# Altium project CONTROLLER_TRK_HV3.PrjPcb
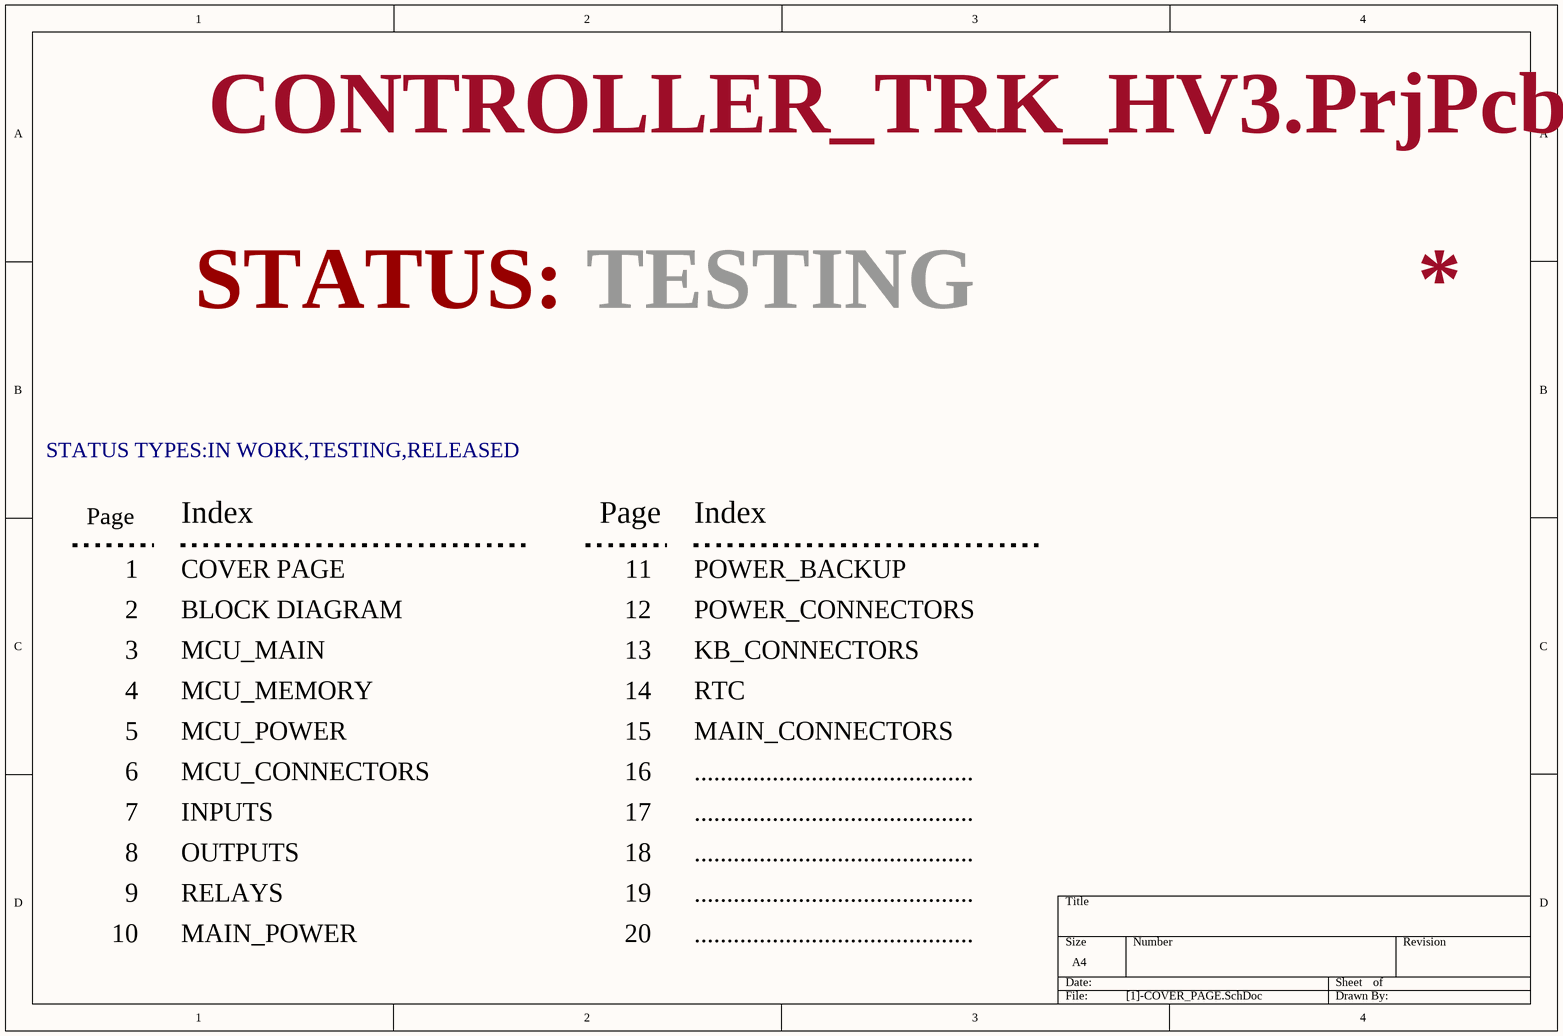
[diagram p0: [1]-COVER_PAGE.SchDoc]
15 sheets, 215 parts. Net scope: flat (ports and power ports of the same name join across sheets).
Board file: CONTROLLER_TRK_HV3.PcbDoc
Sheets:
  [1]-COVER_PAGE.SchDoc
  [2]-BLOCK_DIAGRAM.SchDoc
  [3]-MCU_MAIN.SchDoc
  [4]-MCU_MEMORY.SchDoc
  [5]-MCU_POWER.SchDoc
  [6]-MCU_CONNECTORS.SchDoc
  [7]-INPUTS.SchDoc
  [8]-OUTPUTS.SchDoc
  [9]-RELAYS.SchDoc
  [10]-MAIN_POWER.SchDoc
  [11]-POWER_BACKUP.SchDoc
  [12]-POWER_CONNECTORS.SchDoc
  [13]-KB_CONNECTORS.SchDoc
  [14]-RTC.SchDoc
  [15]-MAIN_CONNECTORS.SchDoc

## Sheet [1]-COVER_PAGE.SchDoc
size A4

### Notes on the sheet
- STATUS:
- TESTING
- STATUS TYPES:IN WORK,TESTING,RELEASED
- Page
- 1
- Index
- COVER PAGE
- 11
- POWER_BACKUP
- 2
- BLOCK DIAGRAM
- 12
- POWER_CONNECTORS
- 3
- 4
- MCU_MAIN
- MCU_MEMORY
- 13
- 14
- RTC
- KB_CONNECTORS
- 5
- 6
- MCU_POWER
- MCU_CONNECTORS
- 15
- 16
- MAIN_CONNECTORS
- ...........................................
- 7
- INPUTS
- 17
- 8
- 9
- OUTPUTS
- RELAYS
- 18
- 19
- 10
- MAIN_POWER
- 20

## Sheet [2]-BLOCK_DIAGRAM.SchDoc
size A4
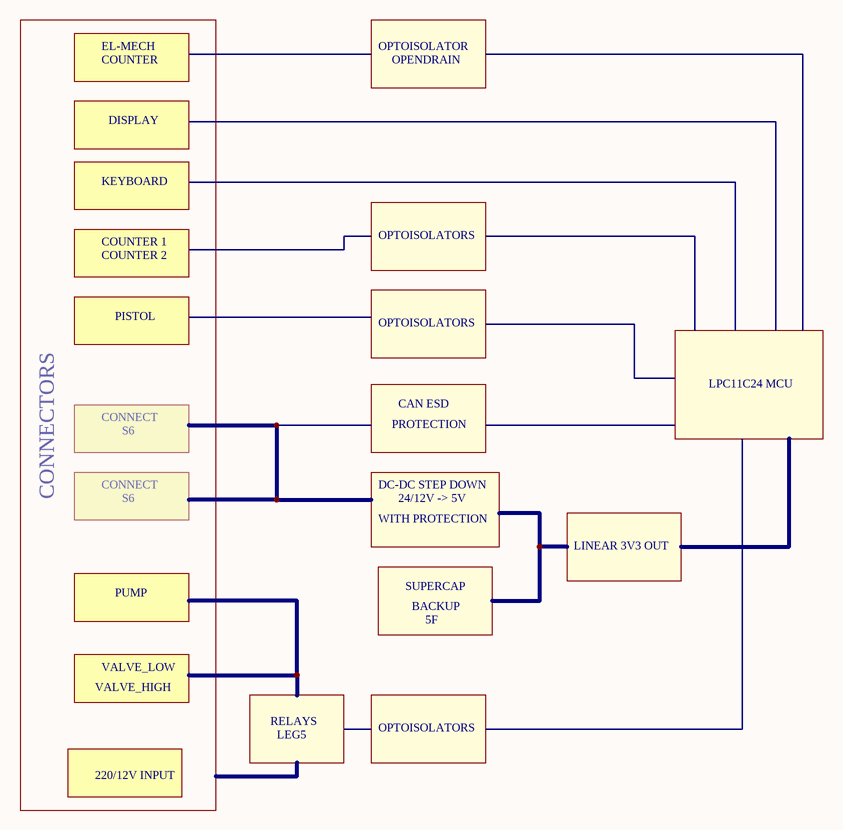
[diagram p1: [2]-BLOCK_DIAGRAM.SchDoc]

### Notes on the sheet
- EL-MECH
- COUNTER
- OPTOISOLATOR
- OPENDRAIN
- DISPLAY
- COUNTER 1
- KEYBOARD
- OPTOISOLATORS
- COUNTER 2
- PISTOL
- CONNECT
- S6
- PROTECTION
- CAN ESD
- LPC11C24 MCU
- CONNECTORS
- DC-DC STEP DOWN
- 24/12V -> 5V
- WITH PROTECTION
- LINEAR 3V3 OUT
- PUMP
- SUPERCAP
- BACKUP
- 5F
- VALVE_HIGH
- VALVE_LOW
- 220/12V INPUT
- RELAYS
- LEG5

## Sheet [3]-MCU_MAIN.SchDoc
size A4
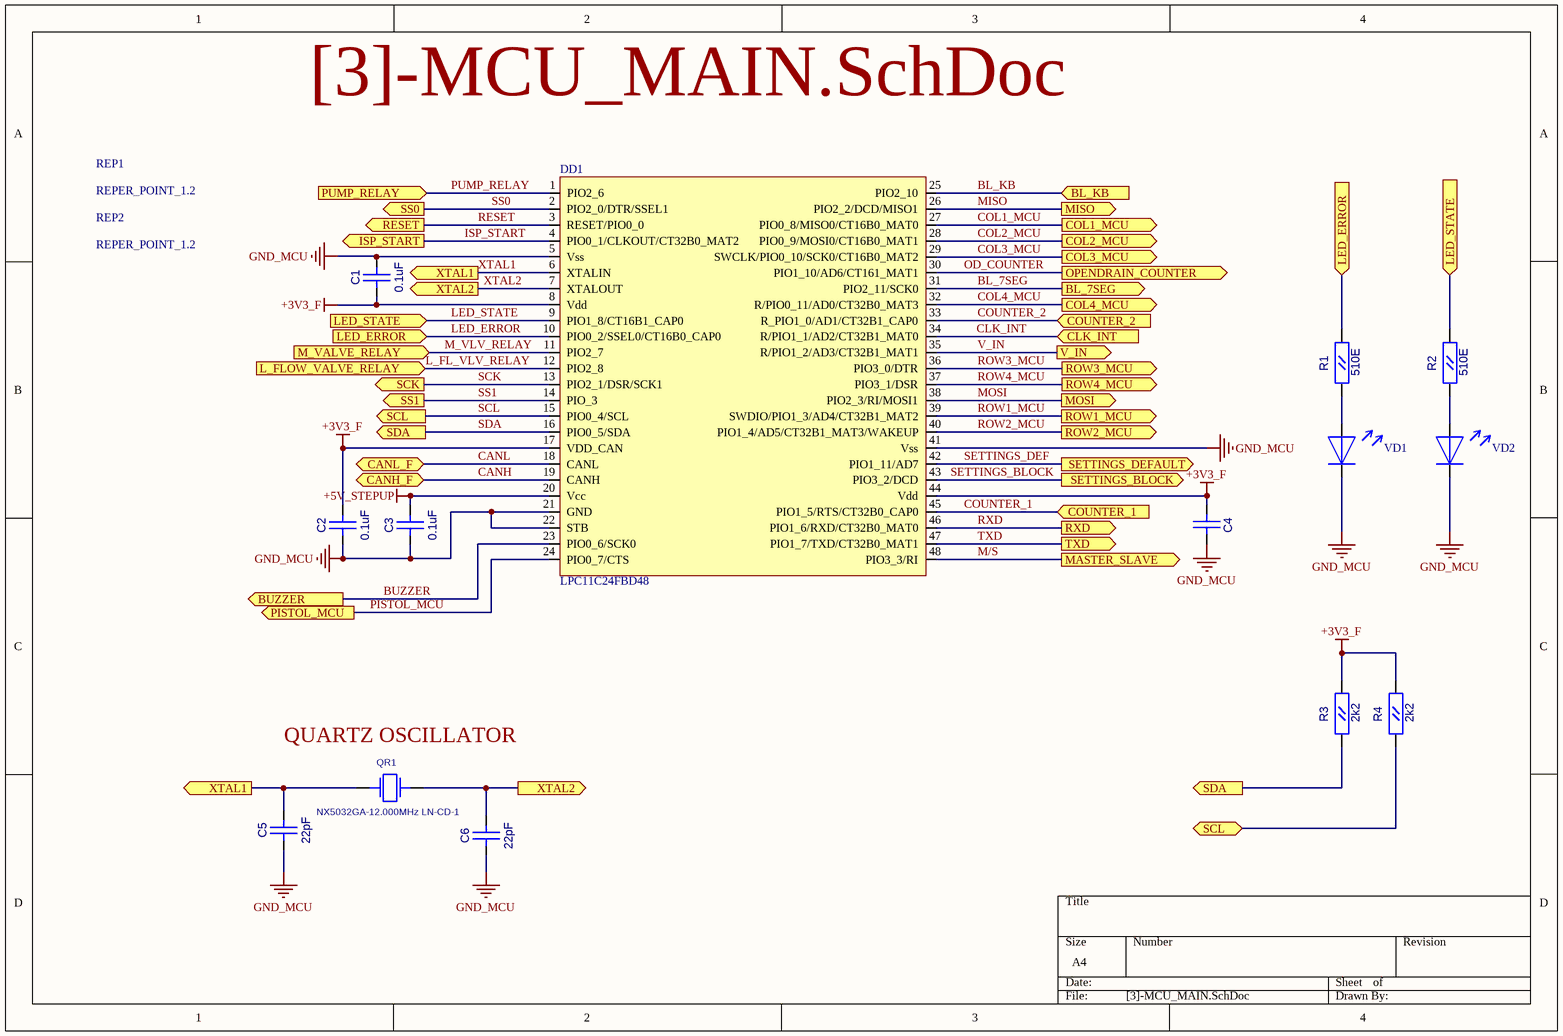
[diagram p2: [3]-MCU_MAIN.SchDoc]

### Parts
C1  0.1uF  [CC0603]
C2  0.1uF  [CC0603]
C3  0.1uF  [CC0603]
C4  (no value)  [CC0603]
C5  22pF  [CC0603]
C6  22pF  [CC0603]
DD1  LPC11C24FBD48  [LQFP48]
QR1  NX5032GA-12.000MHz LN-CD-1  [AC5032_2]
R1  510E  [RC0603]
R2  510E  [RC0603]
R3  2k2  [RC0603]
R4  2k2  [RC0603]
REP1  REPER_POINT_1.2  [REPER1.2]
REP2  REPER_POINT_1.2  [REPER1.2]
VD1  LED_0805  [LED0805]  (value not drawn)
VD2  LED_0805  [LED0805]  (value not drawn)

### Ports
BL_7SEG (out), BL_KB (in), BUZZER (out), CANH_F (bidir), CANL_F (bidir), CLK_INT (in), COL1_MCU (out), COL2_MCU (out), COL3_MCU (out), COL4_MCU (out), COUNTER_1 (in), COUNTER_2 (in), ISP_START (out), L_FLOW_VALVE_RELAY (in), LED_ERROR (in), LED_STATE (in), M_VALVE_RELAY (in), MASTER_SLAVE (out), MISO (out), MOSI (out), OPENDRAIN_COUNTER (out), PISTOL_MCU (out), PUMP_RELAY (in), RESET (out), ROW1_MCU (out), ROW2_MCU (out), ROW3_MCU (out), ROW4_MCU (out), RXD (out), SCK (out), SCL (bidir), SCL (out), SDA (out), SETTINGS_BLOCK (out), SETTINGS_DEFAULT (out), SS0 (out), SS1 (out), TXD (out), V_IN (out), XTAL1 (out), XTAL2 (out)

### Nets
+3V3_F: C1.1(A) C2.2(B) C4.1(A) DD1.8(Vdd) DD1.17(VDD_CAN) DD1.44(Vdd) R3.2(B) R4.2(B)
+5V_STEPUP: C3.2(B) DD1.20(Vcc)
GND_MCU: C1.2(B) C2.1(A) C3.1(A) C4.2(B) C5.1(A) C6.1(A) DD1.5(Vss) DD1.21(GND) DD1.22(STB) DD1.41(Vss) VD1.2 VD2.2
BL_7SEG: DD1.31(PIO2_11/SCK0) ; port BL_7SEG
BL_KB: DD1.25(PIO2_10) ; port BL_KB
BUZZER: DD1.23(PIO0_6/SCK0) ; port BUZZER
CANH: DD1.19(CANH) ; port CANH_F
CANL: DD1.18(CANL) ; port CANL_F
CLK_INT: DD1.34(R/PIO1_1/AD2/CT32B1_MAT0) ; port CLK_INT
COL1_MCU: DD1.27(PIO0_8/MISO0/CT16B0_MAT0) ; port COL1_MCU
COL2_MCU: DD1.28(PIO0_9/MOSI0/CT16B0_MAT1) ; port COL2_MCU
COL3_MCU: DD1.29(SWCLK/PIO0_10/SCK0/CT16B0_MAT2) ; port COL3_MCU
COL4_MCU: DD1.32(R/PIO0_11/AD0/CT32B0_MAT3) ; port COL4_MCU
COUNTER_1: DD1.45(PIO1_5/RTS/CT32B0_CAP0) ; port COUNTER_1
COUNTER_2: DD1.33(R_PIO1_0/AD1/CT32B1_CAP0) ; port COUNTER_2
ISP_START: DD1.4(PIO0_1/CLKOUT/CT32B0_MAT2) ; port ISP_START
L_FL_VLV_RELAY: DD1.12(PIO2_8) ; port L_FLOW_VALVE_RELAY
LED_ERROR: DD1.10(PIO0_2/SSEL0/CT16B0_CAP0) R1.2(B) ; port LED_ERROR
LED_STATE: DD1.9(PIO1_8/CT16B1_CAP0) R2.2(B) ; port LED_STATE
M/S: DD1.48(PIO3_3/RI) ; port MASTER_SLAVE
M_VLV_RELAY: DD1.11(PIO2_7) ; port M_VALVE_RELAY
MISO: DD1.26(PIO2_2/DCD/MISO1) ; port MISO
MOSI: DD1.38(PIO2_3/RI/MOSI1) ; port MOSI
OD_COUNTER: DD1.30(PIO1_10/AD6/CT161_MAT1) ; port OPENDRAIN_COUNTER
PISTOL_MCU: DD1.24(PIO0_7/CTS) ; port PISTOL_MCU
PUMP_RELAY: DD1.1(PIO2_6) ; port PUMP_RELAY
RESET: DD1.3(RESET/PIO0_0) ; port RESET
ROW1_MCU: DD1.39(SWDIO/PIO1_3/AD4/CT32B1_MAT2) ; port ROW1_MCU
ROW2_MCU: DD1.40(PIO1_4/AD5/CT32B1_MAT3/WAKEUP) ; port ROW2_MCU
ROW3_MCU: DD1.36(PIO3_0/DTR) ; port ROW3_MCU
ROW4_MCU: DD1.37(PIO3_1/DSR) ; port ROW4_MCU
RXD: DD1.46(PIO1_6/RXD/CT32B0_MAT0) ; port RXD
SCK: DD1.13(PIO2_1/DSR/SCK1) ; port SCK
SCL: DD1.15(PIO0_4/SCL) R4.1(A) ; port SCL
SDA: DD1.16(PIO0_5/SDA) R3.1(A) ; port SDA
SETTINGS_BLOCK: DD1.43(PIO3_2/DCD) ; port SETTINGS_BLOCK
SETTINGS_DEF: DD1.42(PIO1_11/AD7) ; port SETTINGS_DEFAULT
SS0: DD1.2(PIO2_0/DTR/SSEL1) ; port SS0
SS1: DD1.14(PIO_3) ; port SS1
TXD: DD1.47(PIO1_7/TXD/CT32B0_MAT1) ; port TXD
V_IN: DD1.35(R/PIO1_2/AD3/CT32B1_MAT1) ; port V_IN
XTAL1: C5.2(B) DD1.6(XTALIN) QR1.1 ; port XTAL1
XTAL2: C6.2(B) DD1.7(XTALOUT) QR1.2 ; port XTAL2
NetR1_1: R1.1(A) VD1.1
NetR2_1: R2.1(A) VD2.1

Not connected (* = marked no-connect by the designer): REP1 1; REP2 1

### Notes on the sheet
- (near QR1) QUARTZ OSCILLATOR

### Library data of the parts
C1-C6 = CC0603
  C1-C3: Value: 0.1uF
  C5 C6: Value: 22pF
QR1 = AC5032_2: AC5032/2; Value: NX5032GA-12.000MHz LN-CD-1
R1-R4 = RC0603
  R1 R2: Value: 510E
  R3 R4: Value: 2k2
REP1 REP2 = REPER1.2: Value: REPER_POINT_1.2
DD1 = LPC11C24FBD48: Value: LPC11C24FBD48
VD1 VD2 = LED_0805: Value: LED_0805

## Sheet [4]-MCU_MEMORY.SchDoc
size A4
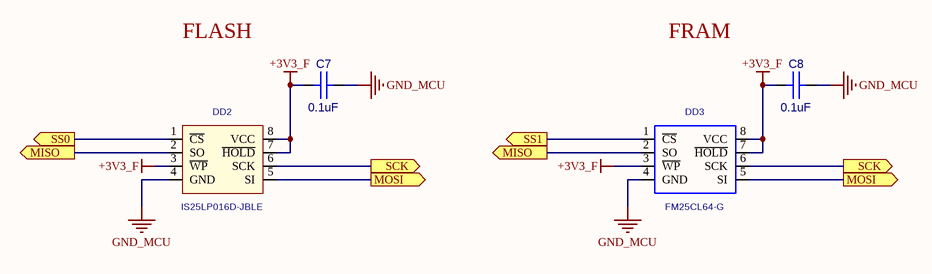
[diagram p3: [4]-MCU_MEMORY.SchDoc]

### Parts
C7  0.1uF  [CC0603]
C8  0.1uF  [CC0603]
DD2  IS25LP016D-JBLE  [EIAJ_SO8]
DD3  FM25CL64-G  [SO-8]

### Ports
MISO (out), MOSI (out), SCK (out), SS0 (out), SS1 (out)

### Nets
+3V3_F: C7.1(A) C8.1(A) DD2.3(~{WP}) DD2.7(~{HOLD}) DD2.8(VCC) DD3.3(~{WP}) DD3.7(~{HOLD}) DD3.8(VCC)
GND_MCU: C7.2(B) C8.2(B) DD2.4(GND) DD3.4(GND)
MISO: DD2.2(SO) DD3.2(SO) ; port MISO
MOSI: DD2.5(SI) DD3.5(SI) ; port MOSI
SCK: DD2.6(SCK) DD3.6(SCK) ; port SCK
SS0: DD2.1(~{CS}) ; port SS0
SS1: DD3.1(~{CS}) ; port SS1

### Notes on the sheet
- FLASH
- FRAM

### Library data of the parts
C7 C8 = CC0603: Value: 0.1uF
DD2 = S25FL016A0LMFI01: Value: IS25LP016D-JBLE
DD3 = FM25CL64-G: Value: *

## Sheet [5]-MCU_POWER.SchDoc
size A4
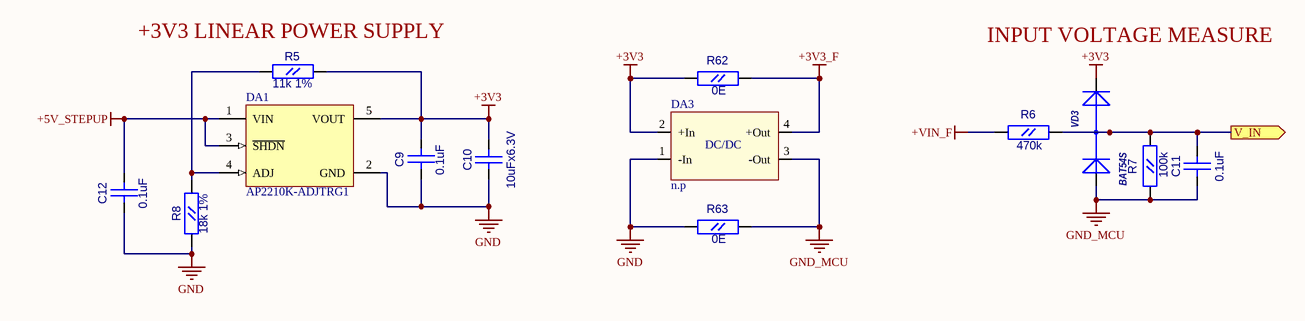
[diagram p4: [5]-MCU_POWER.SchDoc]

### Parts
C9  0.1uF  [CC0603]
C10  10uFx6.3V  [CC0805]
C11  0.1uF  [CC0603]
C12  0.1uF  [CC0603]
DA1  AP2210K-ADJTRG1  [SOT23-5]
DA3  n.p  [CME0303S3C]
R5  11k 1%  [RC0603]
R6  470k  [RC0603]
R7  100k  [RC0603]
R8  18k 1%  [RC0603]
R62  0E  [RC0805]
R63  0E  [RC0805]
VD3  BAT54S  [SOT-23(GSD)]

### Ports
V_IN (out)

### Nets
+3V3: C9.1(A) C10.2(B) DA1.5(VOUT) DA3.2(+In) R5.2(B) R62.1(A) VD3.2(K)
+3V3_F: DA3.4(+Out) R62.2(B)
+5V_STEPUP: C12.1(A) DA1.1(VIN) DA1.3(~{SHDN})
+VIN_F: R6.1(A)
GND: C9.2(B) C10.1(A) C12.2(B) DA1.2(GND) DA3.1(-In) R8.1(A) R63.1(A)
GND_MCU: C11.1(A) DA3.3(-Out) R7.1(A) R63.2(B) VD3.1(A)
V_IN: C11.2(B) R6.2(B) R7.2(B) VD3.3(AK) ; port V_IN
NetDA1_4: DA1.4(ADJ) R5.1(A) R8.2(B)

### Notes on the sheet
- (near R5) +3V3 LINEAR POWER SUPPLY
- (near VD3) INPUT VOLTAGE MEASURE
- (in symbol CME0303S3C) DC/DC

### Library data of the parts
C9 C11 C12 = CC0603: Value: 0.1uF
C10 = CC0805: Value: 10uFx6.3V
DA1 = MCP1824T-ADJE/OT: 300 mA, Low Voltage, Low Quiescent Current LDO Regulator, 5-Pin SOT-223, Extended Temperature, Tape and Reel; Published: 29-Jan-2009; DatasheetVersion: revA, Aug-2007; PackageVersion: revAW, Oct-2008; PackageReference: SOT-223-DC5; Publisher: Altium Limited; PackageDescription: 5-Lead Plastic Small Outline Transistor (DC) [SOT-223]; ComponentLink1Description: Manufacturer Link; ComponentLink1URL: http://www.microchip.com; ComponentLink2Description: Datasheet; ComponentLink2URL: http://ww1.microchip.com/downloads/en/DeviceDoc/22070a.pdf; ComponentLink3Description: Packaging Specification; ComponentLink3URL: http://ww1.microchip.com/downloads/en/PackagingSpec/00049AW.pdf
DA3 = CME0303S3C: DC/DC converter
R5-R8 = RC0603
  R5: Value: 11k 1%
  R6: Value: 470k
  R7: Value: 100k
  R8: Value: 18k 1%
R62 R63 = RC0805: Value: 0E
VD3 = BAT54S: 1.0 Ampere General Purpose Rectifier; ComponentField6: Published 8-Jun-2000, Modified 11-July-2000: SIM Model Added.; Value: *

## Sheet [6]-MCU_CONNECTORS.SchDoc
size A4
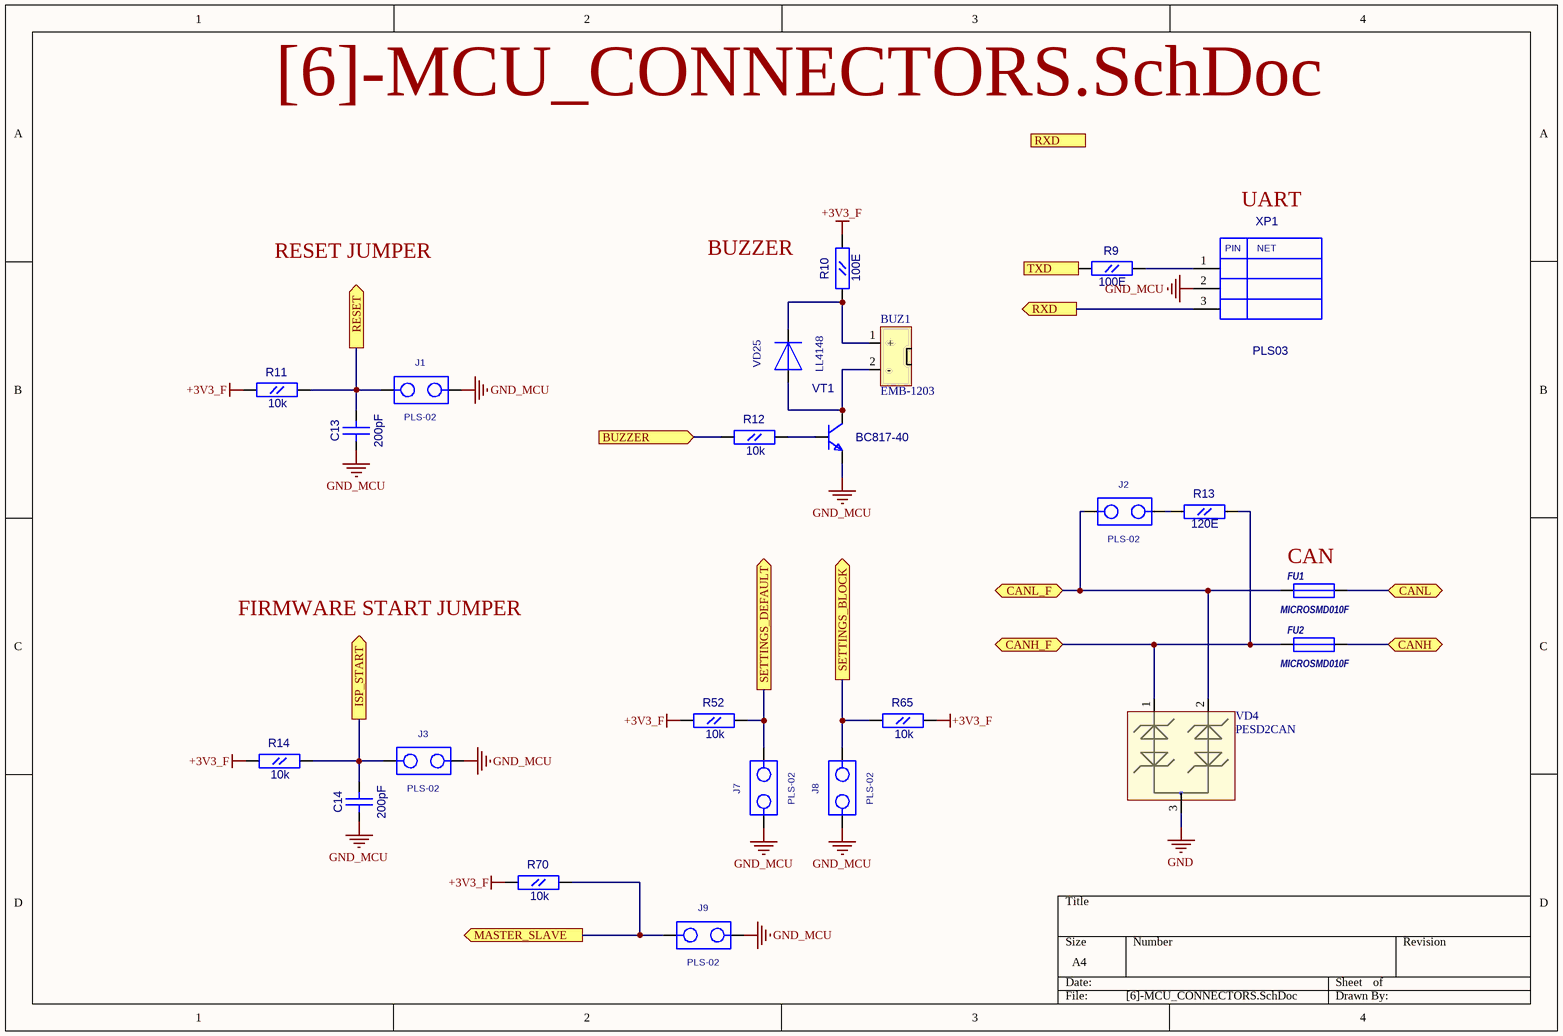
[diagram p5: [6]-MCU_CONNECTORS.SchDoc]

### Parts
BUZ1  EMB-1203  [BUZZER_12]
C13  200pF  [CC0603]
C14  200pF  [CC0603]
FU1  MICROSMD010F  [RC1210]
FU2  MICROSMD010F  [RC1210]
J1  PLS-02  [PLS-02]
J2  PLS-02  [PLS-02]
J3  PLS-02  [PLS-02]
J7  PLS-02  [PLS-02]
J8  PLS-02  [PLS-02]
J9  PLS-02  [PLS-02]
R9  100E  [RC0603]
R10  100E  [RC0603]
R11  10k  [RC0603]
R12  10k  [RC0603]
R13  120E  [RC0805]
R14  10k  [RC0603]
R52  10k  [RC0603]
R65  10k  [RC0603]
R70  10k  [RC0603]
VD4  PESD2CAN  [SOT-23(123)]
VD25  LL4148  [SOD-80]
VT1  BC817-40  [SOT-23(123)]
XP1  PLS03  [PLS-03]

### Ports
BUZZER (in), CANH (bidir), CANH_F (bidir), CANL (bidir), CANL_F (bidir), ISP_START (out), MASTER_SLAVE (out), RESET (out), RXD (out), SETTINGS_BLOCK (out), SETTINGS_DEFAULT (out), TXD (out)

### Nets
+3V3_F: R10.2(B) R11.1(A) R14.1(A) R52.1(A) R65.2(B) R70.1(A)
GND: VD4.3
GND_MCU: C13.1(A) C14.1(A) J1.2 J3.2 J7.1 J8.1 J9.2 VT1.2(E) XP1.2
BUZZER: R12.1(A) ; port BUZZER
CANH: FU2.1 R13.2(B) VD4.1 ; port CANH_F
CANL: FU1.1 J2.1 VD4.2 ; port CANL_F
ISP_START: C14.2(B) J3.1 R14.2(B) ; port ISP_START
M/S: J9.1 R70.2(B) ; port MASTER_SLAVE
RESET: C13.2(B) J1.1 R11.2(B) ; port RESET
RXD: XP1.3 ; port RXD
SETTINGS_BLOCK: J8.2 R65.1(A) ; port SETTINGS_BLOCK
SETTINGS_DEF: J7.2 R52.2(B) ; port SETTINGS_DEFAULT
TXD: R9.1(A) ; port TXD
NetBUZ1_1: BUZ1.1(+) R10.1(A) VD25.2(+)
NetBUZ1_2: BUZ1.2(-) VD25.1(-) VT1.3(C)
NetFU1_2: FU1.2 ; port CANL
NetFU2_2: FU2.2 ; port CANH
NetJ2_2: J2.2 R13.1(A)
NetR9_2: R9.2(B) XP1.1
NetR12_2: R12.2(B) VT1.1(B)

### Notes on the sheet
- UART
- RESET JUMPER
- BUZZER
- (near FU1) CAN
- FIRMWARE START JUMPER
- (in symbol PLS03) PIN; NET

### Library data of the parts
BUZ1 = EMB-1203: Buzzer diameter 12mm 3V; Value: EMB-1203
C13 C14 = CC0603: Value: 200pF
FU1 FU2 = MICROSMD: Value: *
R9-R12 R14 R52 R65 R70 = RC0603
  R9 R10: Value: 100E
  R11 R12 R14 R52 R65 R70: Value: 10k
R13 = RC0805: Value: 120E
VD4 = PESD2CAN: TVS for CAN
VT1 = BC846BLT1: NPN 500ma transistor; ComponentField7: Published 29-Sep-2000; OriginalName: BC846BLT1; Value: BC817-40
J1-J3 J7-J9 = PLS-02: Value: *
VD25 = LL4148: Value: *
XP1 = PLS03: Value: *

## Sheet [7]-INPUTS.SchDoc
size A4
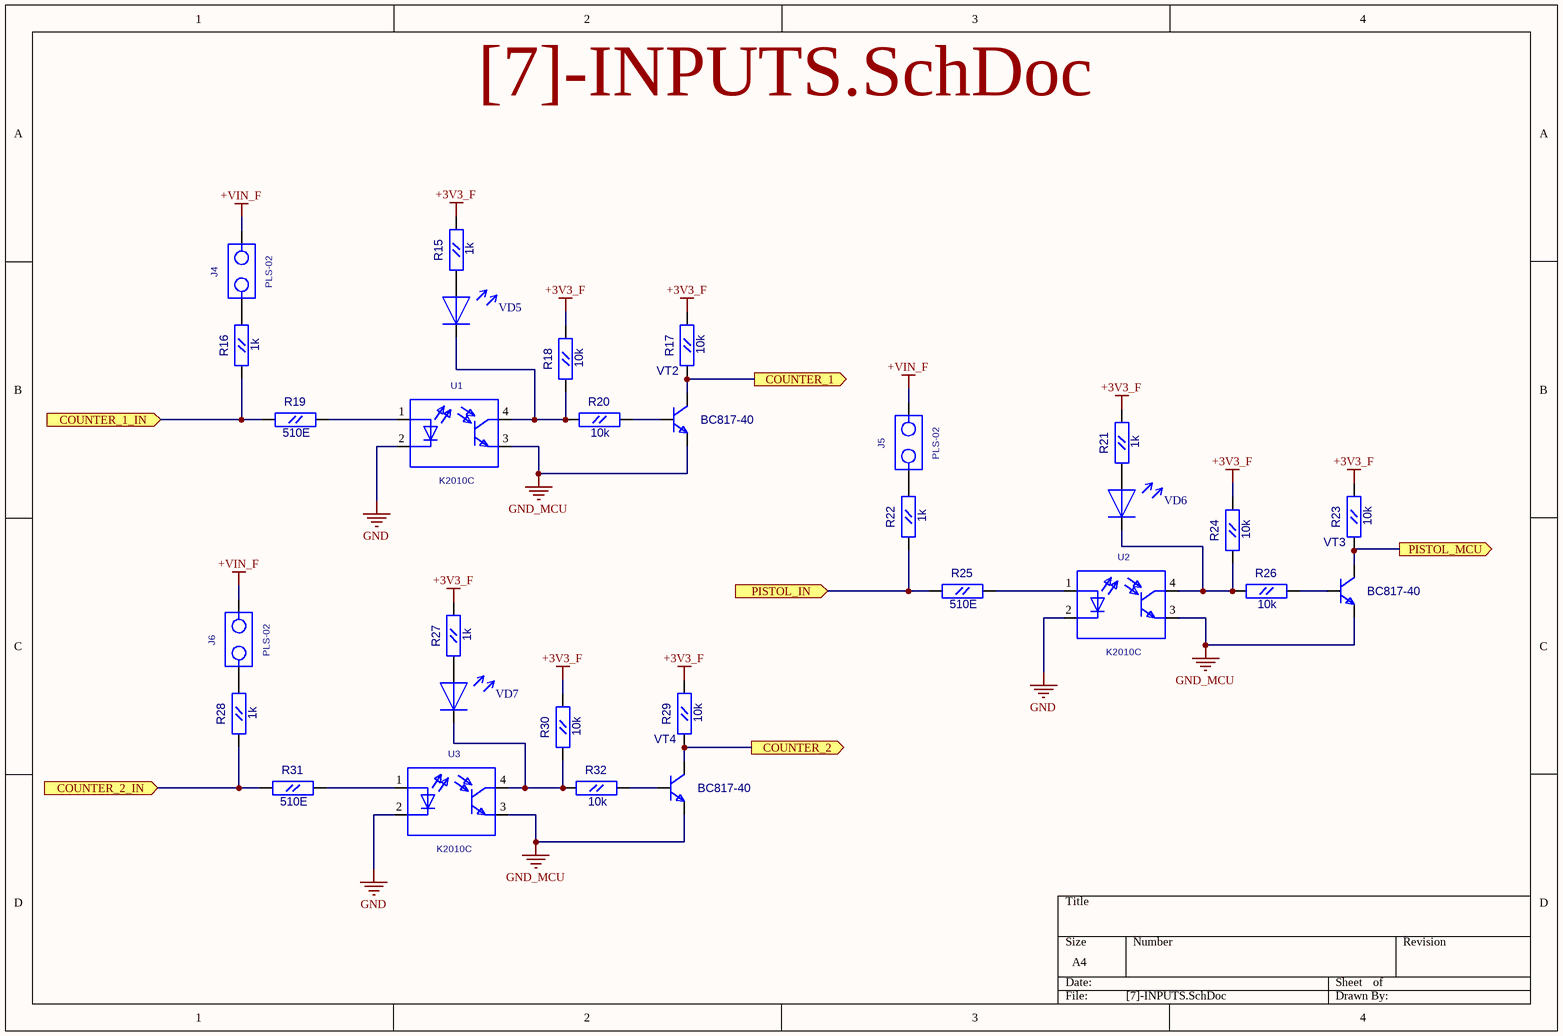
[diagram p6: [7]-INPUTS.SchDoc]

### Parts
J4  PLS-02  [PLS-02]
J5  PLS-02  [PLS-02]
J6  PLS-02  [PLS-02]
R15  1k  [RC0603]
R16  1k  [RC0603]
R17  10k  [RC0603]
R18  10k  [RC0603]
R19  510E  [RC0603]
R20  10k  [RC0603]
R21  1k  [RC0603]
R22  1k  [RC0603]
R23  10k  [RC0603]
R24  10k  [RC0603]
R25  510E  [RC0603]
R26  10k  [RC0603]
R27  1k  [RC0603]
R28  1k  [RC0603]
R29  10k  [RC0603]
R30  10k  [RC0603]
R31  510E  [RC0603]
R32  10k  [RC0603]
U1  K2010C  [PC817]
U2  K2010C  [PC817]
U3  K2010C  [PC817]
VD5  LED_0805  [LED0805]  (value not drawn)
VD6  LED_0805  [LED0805]  (value not drawn)
VD7  LED_0805  [LED0805]  (value not drawn)
VT2  BC817-40  [SOT-23(123)]
VT3  BC817-40  [SOT-23(123)]
VT4  BC817-40  [SOT-23(123)]

### Ports
COUNTER_1 (out), COUNTER_1_IN (in), COUNTER_2 (out), COUNTER_2_IN (in), PISTOL_IN (in), PISTOL_MCU (out)

### Nets
+3V3_F: R15.2(B) R17.2(B) R18.2(B) R21.2(B) R23.2(B) R24.2(B) R27.2(B) R29.2(B) R30.2(B)
+VIN_F: J4.2 J5.2 J6.2
GND: U1.2 U2.2 U3.2
GND_MCU: U1.3 U2.3 U3.3 VT2.2(E) VT3.2(E) VT4.2(E)
COUNTER_1: R17.1(A) VT2.3(C) ; port COUNTER_1
COUNTER_2: R29.1(A) VT4.3(C) ; port COUNTER_2
PISTOL_MCU: R23.1(A) VT3.3(C) ; port PISTOL_MCU
NetJ4_1: J4.1 R16.2(B)
NetJ5_1: J5.1 R22.2(B)
NetJ6_1: J6.1 R28.2(B)
NetR15_1: R15.1(A) VD5.1
NetR16_1: R16.1(A) R19.1(A) ; port COUNTER_1_IN
NetR18_1: R18.1(A) R20.1(A) U1.4 VD5.2
NetR19_2: R19.2(B) U1.1
NetR20_2: R20.2(B) VT2.1(B)
NetR21_1: R21.1(A) VD6.1
NetR22_1: R22.1(A) R25.1(A) ; port PISTOL_IN
NetR24_1: R24.1(A) R26.1(A) U2.4 VD6.2
NetR25_2: R25.2(B) U2.1
NetR26_2: R26.2(B) VT3.1(B)
NetR27_1: R27.1(A) VD7.1
NetR28_1: R28.1(A) R31.1(A) ; port COUNTER_2_IN
NetR30_1: R30.1(A) R32.1(A) U3.4 VD7.2
NetR31_2: R31.2(B) U3.1
NetR32_2: R32.2(B) VT4.1(B)

### Library data of the parts
R15-R32 = RC0603
  R15 R16 R21 R22 R27 R28: Value: 1k
  R17 R18 R20 R23 R24 R26 R29 R30 R32: Value: 10k
  R19 R25 R31: Value: 510E
U1-U3 = K10102C: Value: *
VT2-VT4 = BC846BLT1: as VT1 on sheet [6]-MCU_CONNECTORS; OriginalName: BC846BLT1; Value: BC817-40
J4-J6 = PLS-02: Value: *
VD5-VD7 = LED_0805: Value: LED_0805

## Sheet [8]-OUTPUTS.SchDoc
size A4
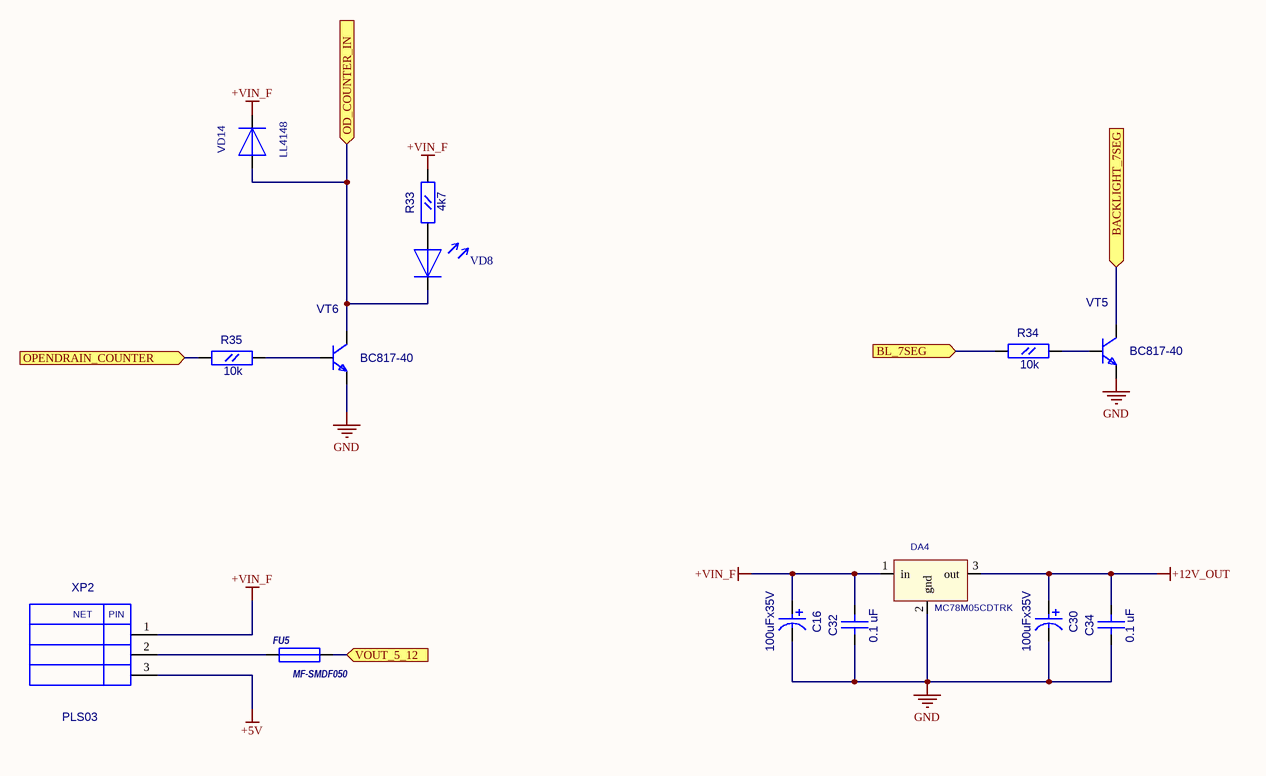
[diagram p7: [8]-OUTPUTS.SchDoc]

### Parts
C16  100uFx35V  [CC8X3.5]
C30  100uFx35V  [CC8X3.5]
C32  0.1 uF  [CC0603]
C34  0.1 uF  [CC0603]
DA4  MC78M05CDTRK  [D-PAK(TO-252AA)]
FU5  MF-SMDF050  [MF-SMDF]
R33  4k7  [RC0603]
R34  10k  [RC0603]
R35  10k  [RC0603]
VD8  LED_0805  [LED0805]  (value not drawn)
VD14  LL4148  [SOD-80]
VT5  BC817-40  [SOT-23(123)]
VT6  BC817-40  [SOT-23(123)]
XP2  PLS03  [PLS-03]

### Ports
BACKLIGHT_7SEG (in), BL_7SEG (in), OD_COUNTER_IN (in), OPENDRAIN_COUNTER (in), VOUT_5_12 (in)

### Nets
+5V: XP2.3
+12V_OUT: C30.1 C34.1(A) DA4.3(out)
+VIN_F: C16.1 C32.1(A) DA4.1(in) R33.2(B) VD14.2(+) XP2.1
GND: C16.2 C30.2 C32.2(B) C34.2(B) DA4.2(gnd) VT5.2(E) VT6.2(E)
BL_7SEG: R34.1(A) ; port BL_7SEG
OD_COUNTER: R35.1(A) ; port OPENDRAIN_COUNTER
NetFU5_1: FU5.1 XP2.2
NetFU5_2: FU5.2 ; port VOUT_5_12
NetR33_1: R33.1(A) VD8.1
NetR34_2: R34.2(B) VT5.1(B)
NetR35_2: R35.2(B) VT6.1(B)
NetVD8_2: VD8.2 VD14.1(-) VT6.3(C) ; port OD_COUNTER_IN
NetVT5_3: VT5.3(C) ; port BACKLIGHT_7SEG

### Notes on the sheet
- (in symbol PLS03) NET; PIN

### Library data of the parts
C16 C30 = CAP_8mm: Radial capacitor; Value: 100uFx35V
C32 C34 = CC0603: Value: 0.1 uF
DA4 = MC78M05CDTRK: MC78M12CDTRK; Value: *
FU5 = MF-SMDF: Value: MF-SMDF050
R33-R35 = RC0603
  R33: Value: 4k7
  R34 R35: Value: 10k
VT5 VT6 = BC846BLT1: as VT1 on sheet [6]-MCU_CONNECTORS; OriginalName: BC846BLT1; Value: BC817-40
VD8 = LED_0805: Value: LED_0805
VD14 = LL4148: Value: *
XP2 = PLS03: Value: *

## Sheet [9]-RELAYS.SchDoc
size A4
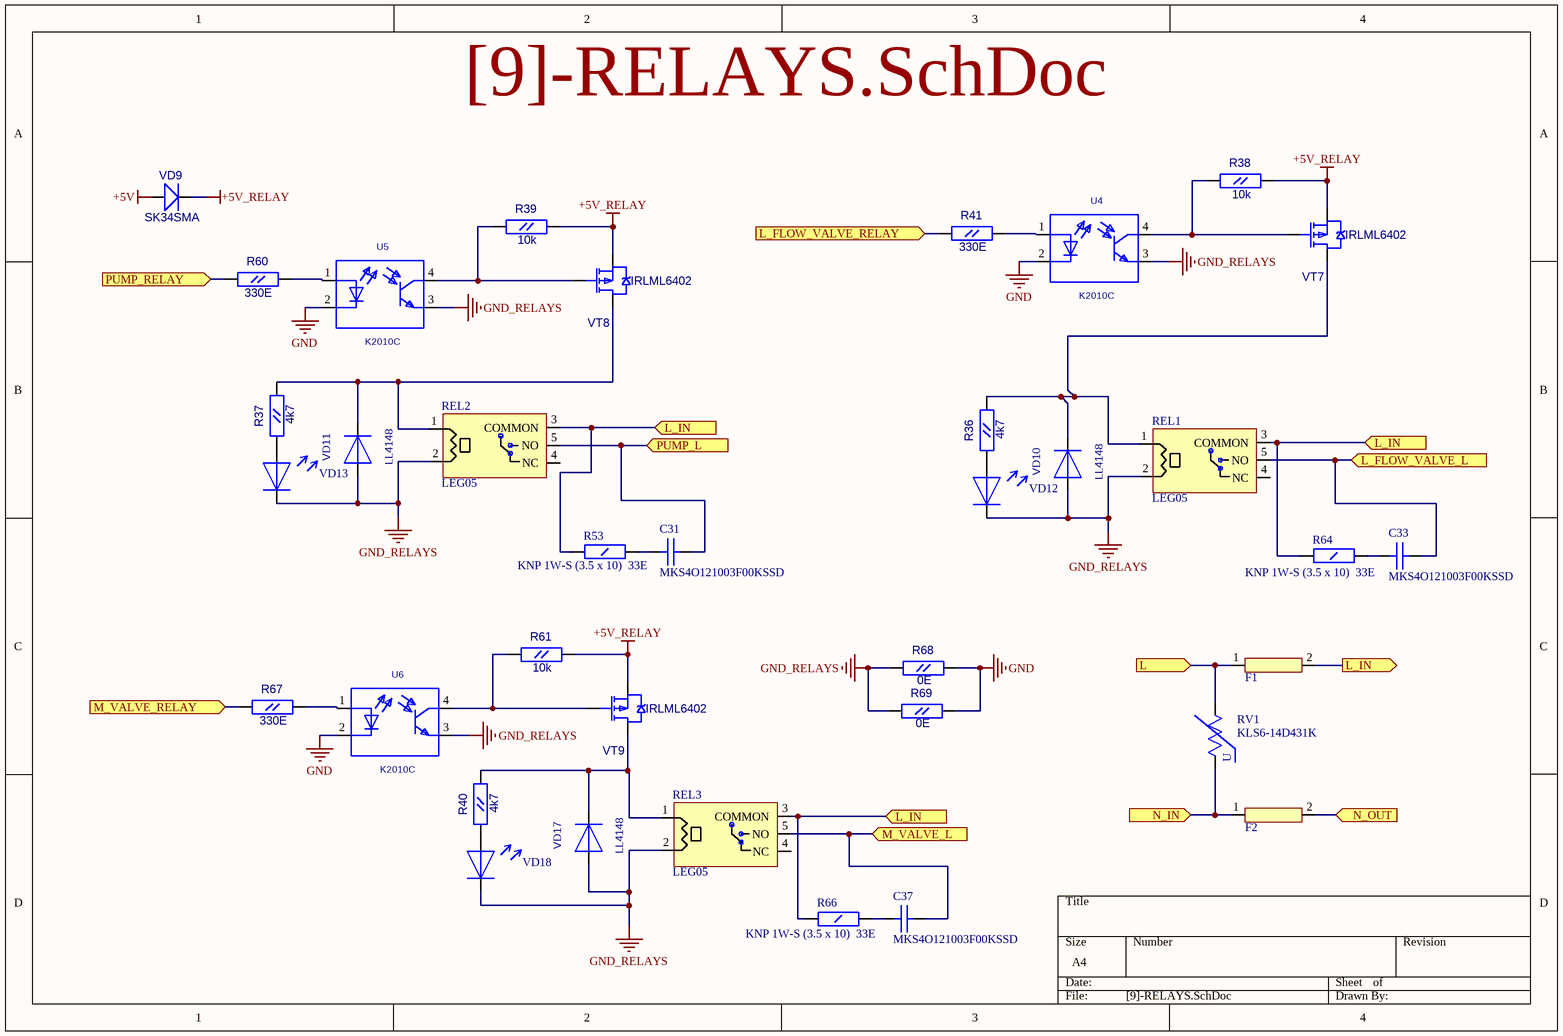
[diagram p8: [9]-RELAYS.SchDoc]

### Parts
C31  MKS4O121003F00KSSD  [CAP_HV_13x5]
C33  MKS4O121003F00KSSD  [CAP_HV_13x5]
C37  MKS4O121003F00KSSD  [CAP_HV_13x5]
F1  KLS5-266(5x20)  [Fuse_5x20]  (value not drawn)
F2  KLS5-266(5x20)  [Fuse_5x20]  (value not drawn)
R36  4k7  [RC0603]
R37  4k7  [RC0603]
R38  10k  [RC0603]
R39  10k  [RC0603]
R40  4k7  [RC0603]
R41  330E  [RC0603]
R53  KNP 1W-S (3.5 x 10)  33E  [RES_10x4_THD]
R60  330E  [RC0603]
R61  10k  [RC0603]
R64  KNP 1W-S (3.5 x 10)  33E  [RES_10x4_THD]
R66  KNP 1W-S (3.5 x 10)  33E  [RES_10x4_THD]
R67  330E  [RC0603]
R68  0E  [RC0805]
R69  0E  [RC0805]
REL1  LEG05  [RELAY_SRD-05]
REL2  LEG05  [RELAY_SRD-05]
REL3  LEG05  [RELAY_SRD-05]
RV1  KLS6-14D431K  [Varistor_14MM]
U4  K2010C  [PC817]
U5  K2010C  [PC817]
U6  K2010C  [PC817]
VD9  SK34SMA  [SMA]
VD10  LL4148  [SOD-80]
VD11  LL4148  [SOD-80]
VD12  LED_0805  [LED0805]  (value not drawn)
VD13  LED_0805  [LED0805]  (value not drawn)
VD17  LL4148  [SOD-80]
VD18  LED_0805  [LED0805]  (value not drawn)
VT7  IRLML6402  [SOT-23(123)]
VT8  IRLML6402  [SOT-23(123)]
VT9  IRLML6402  [SOT-23(123)]

### Ports
L (in), L_FLOW_VALVE_L (in), L_FLOW_VALVE_RELAY (in), L_IN (in), L_IN (out), M_VALVE_L (in), M_VALVE_RELAY (in), N_IN (in), N_OUT (in), PUMP_L (in), PUMP_RELAY (in)

### Nets
+5V: VD9.1(A)
+5V_RELAY: R38.2(B) R39.2(B) R61.2(B) VD9.2(K) VT7.2(S) VT8.2(S) VT9.2(S)
GND: R68.2(B) R69.2(B) U4.2 U5.2 U6.2
GND_RELAYS: R68.1(A) R69.1(A) REL1.2 REL2.2 REL3.2 U4.3 U5.3 U6.3 VD10.1(-) VD11.1(-) VD12.2 VD13.2 VD17.1(-) VD18.2
L_FL_VLV_RELAY: R41.1(A) ; port L_FLOW_VALVE_RELAY
M_VLV_RELAY: R67.1(A) ; port M_VALVE_RELAY
PUMP_RELAY: R60.1(A) ; port PUMP_RELAY
NetC31_1: C31.1(A) R53.1(A)
NetC31_2: C31.2(B) REL2.5(NO) ; port PUMP_L
NetC33_1: C33.1(A) R64.1(A)
NetC33_2: C33.2(B) REL1.5(NO) ; port L_FLOW_VALVE_L
NetC37_1: C37.1(A) R66.1(A)
NetC37_2: C37.2(B) REL3.5(NO) ; port M_VALVE_L
NetF1_1: F1.1 RV1.2(B) ; port L
NetF1_2: F1.2 R53.2(B) R64.2(B) R66.2(B) REL1.3(COMMON) REL2.3(COMMON) REL3.3(COMMON) ; port L_IN
NetF2_1: F2.1 RV1.1(A) ; port N_IN
NetF2_2: F2.2 ; port N_OUT
NetR36_1: R36.1(A) VD12.1
NetR36_2: R36.2(B) REL1.1 VD10.2(+) VT7.3(D)
NetR37_1: R37.1(A) VD13.1
NetR37_2: R37.2(B) REL2.1 VD11.2(+) VT8.3(D)
NetR38_1: R38.1(A) U4.4 VT7.1(G)
NetR39_1: R39.1(A) U5.4 VT8.1(G)
NetR40_1: R40.1(A) VD18.1
NetR40_2: R40.2(B) REL3.1 VD17.2(+) VT9.3(D)
NetR41_2: R41.2(B) U4.1
NetR60_2: R60.2(B) U5.1
NetR61_1: R61.1(A) U6.4 VT9.1(G)
NetR67_2: R67.2(B) U6.1

Not connected (* = marked no-connect by the designer): REL1 4(NC); REL2 4(NC); REL3 4(NC)

### Notes on the sheet
- (in symbol KLS6-14D431K) U

### Library data of the parts
C31 C33 C37 = CAP_HV_13x5: Value: MKS4O121003F00KSSD
F1 F2 = Fuse KLS5-266(5x20): Value: KLS5-266(5x20)
R36-R41 R60 R61 R67 = RC0603
  R36 R37 R40: Value: 4k7
  R38 R39 R61: Value: 10k
  R41 R60 R67: Value: 330E
R53 R64 R66 = RC_1003_THR: THR resisto r10x3mm 0.5W; Value: KNP 1W-S (3.5 x 10)  33E
R68 R69 = RC0805: Value: 0E
REL1-REL3 = SRD-05VDC-SL-C: Relay 5V 70mA Songle; Value: LEG05
RV1 = KLS6-14D431K: Varistor diameter 14mm; Value: KLS6-14D431K
U4-U6 = K10102C: Value: *
VD9 = SK34SMA: Schottky Rectifier; Value: {Value}
VT7-VT9 = IRLML6402: HEXFET Power MOSFET; OriginalName: IRLML5103; ComponentField7: Published 8-Jun-2000; Value: {Value}
VD10 VD11 VD17 = LL4148: Value: *
VD12 VD13 VD18 = LED_0805: Value: LED_0805

## Sheet [10]-MAIN_POWER.SchDoc
size A4
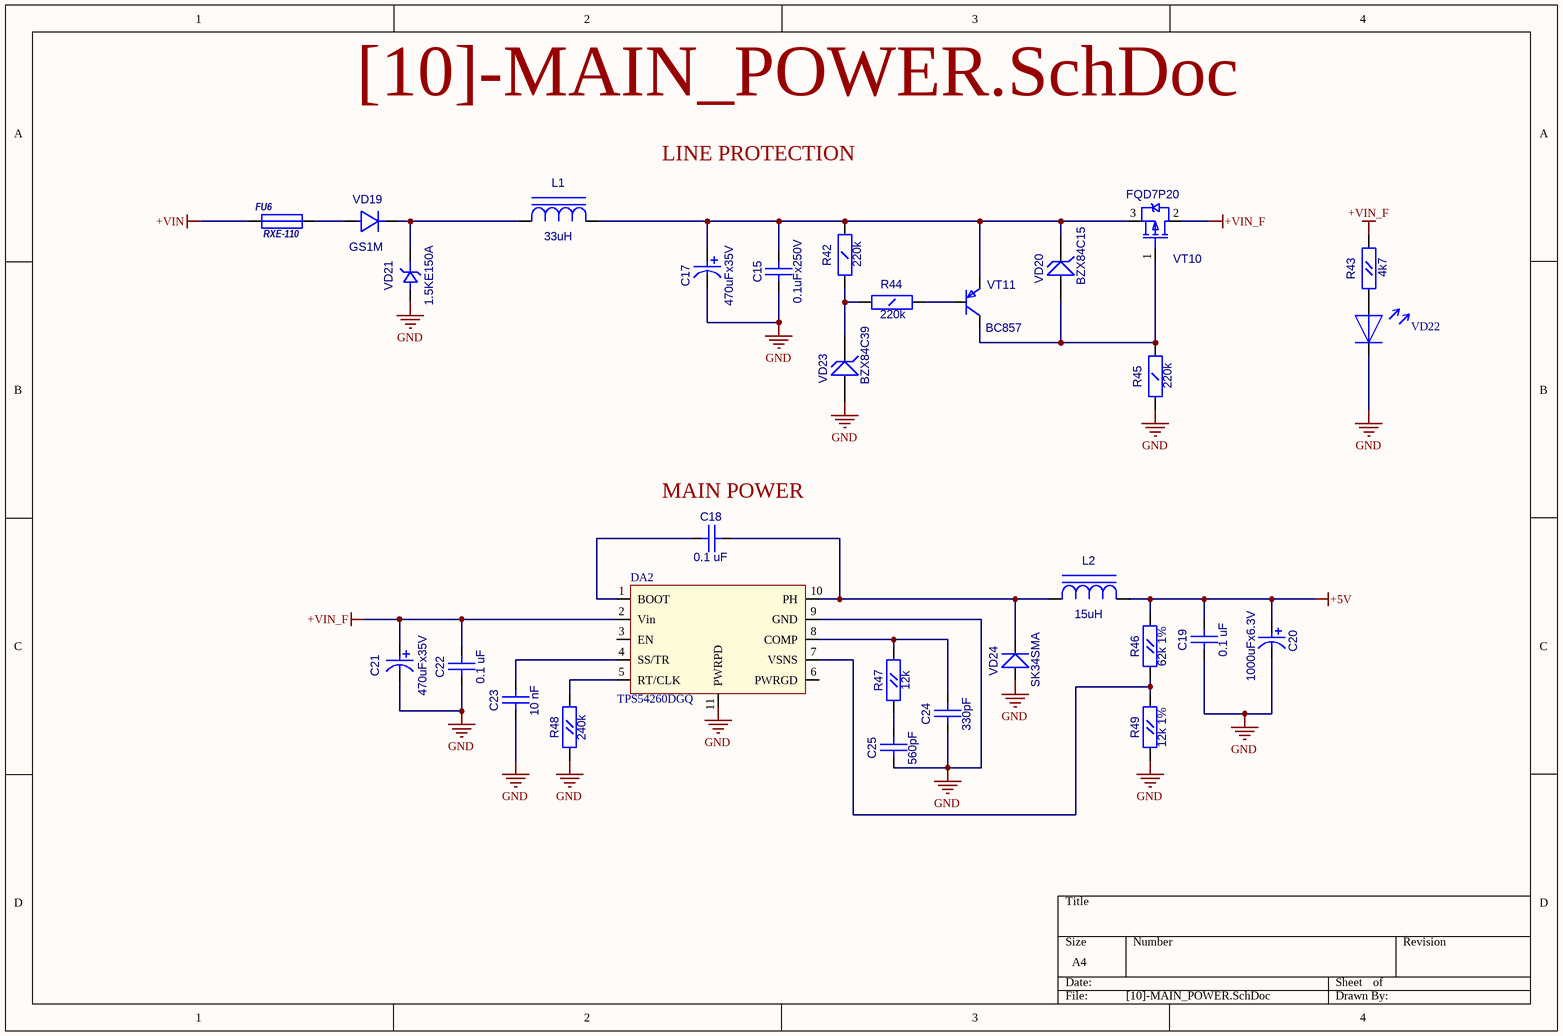
[diagram p9: [10]-MAIN_POWER.SchDoc]

### Parts
C15  0.1uFx250V  [CC1206]
C17  value 470uFx35V  [CC16X10_CAP0.5(1)(Primary)]  (hidden comment: CAP0.5(1))
C18  0.1 uF  [CC0603]
C19  0.1 uF  [CC0603]
C20  1000uFx6.3V  [CC8X3.5]
C21  470uFx35V  [CC16X10_CAP0.5(1)(Primary)]
C22  0.1 uF  [CC0603]
C23  10 nF  [CC0603]
C24  330pF  [CC0603]
C25  560pF  [CC0603]
DA2  TPS54260DGQ  [S-PDSO-G10]
FU6  RXE-110  [RXE-110]
L1  value 33uH  [SDR0805]  (hidden comment: SDR0805)
L2  15uH  [SDR0805]
R42  220k  [RC1206]
R43  4k7  [RC0603]
R44  220k  [RC1206]
R45  220k  [RC1206]
R46  62k 1%  [RC0603]
R47  12k  [RC0603]
R48  240k  [RC0603]
R49  12k 1%  [RC0603]
VD19  GS1M  [SMA]
VD20  BZX84C15  [SOT-23(123)]
VD21  1.5KE150A  [DO-201]
VD22  LED_0805  [LED0805]  (value not drawn)
VD23  BZX84C39  [SOT-23(123)]
VD24  SK34SMA  [SMA]
VT10  FQD7P20  [D-PAK(TO-252AA)]
VT11  BC857  [SOT-23(123)]

### Nets
+5V: C19.1(A) C20.1 L2.2(A) R46.2(B)
+VIN: FU6.1
+VIN_F: C21.2 C22.1(A) DA2.2(Vin) R43.2(B) VT10.2(D)
GND: C15.1(A) C17.1 C19.2(B) C20.2 C21.1 C22.2(B) C23.2(B) C24.2(B) C25.2(B) DA2.9(GND) DA2.11(PWRPD) R45.1(A) R48.1(A) R49.1(A) VD21.1(A) VD22.2 VD23.1(A) VD24.1(A)
NetC15_2: C15.2(B) C17.2 L1.2(A) R42.2(B) VD20.3(K) VT10.3(S) VT11.2(E)
NetC18_1: C18.1(A) DA2.10(PH) L2.1(C) VD24.2(K)
NetC18_2: C18.2(B) DA2.1(BOOT)
NetC23_1: C23.1(A) DA2.4(SS/TR)
NetC24_1: C24.1(A) DA2.8(COMP) R47.2(B)
NetC25_1: C25.1(A) R47.1(A)
NetDA2_5: DA2.5(RT/CLK) R48.2(B)
NetDA2_7: DA2.7(VSNS) R46.1(A) R49.2(B)
NetFU6_2: FU6.2 VD19.1(A)
NetL1_1: L1.1(C) VD19.2(K) VD21.2(K)
NetR42_1: R42.1(A) R44.1(A) VD23.3(K)
NetR43_1: R43.1(A) VD22.1
NetR44_2: R44.2(B) VT11.1(B)
NetR45_2: R45.2(B) VD20.1(A) VT10.1(G) VT11.3(C)

Not connected (* = marked no-connect by the designer): DA2 3(EN) 6(PWRGD)

### Notes on the sheet
- LINE PROTECTION
- (near C18) MAIN POWER

### Library data of the parts
C15 = CC1206: Value: 0.1uFx250V
C18 C19 C22-C25 = CC0603
  C18 C19 C22: Value: 0.1 uF
  C23: Value: 10 nF
  C24: Value: 330pF
  C25: Value: 560pF
C20 = CAP0.35: Value: 1000uFx6.3V
C21 = CAP0.5(1): Value: 470uFx35V
L2 = SDR0805: Value: 15uH
R42 R44 R45 = RC1206: Value: 220k
R43 R46-R49 = RC0603
  R43: Value: 4k7
  R46: Value: 62k 1%
  R47: Value: 12k
  R48: Value: 240k
  R49: Value: 12k 1%
VD19 = GS1M: Value: {Value}
VD20 VD23 = BZX84: Zener Voltage Regulator Diode
  VD20: Value: BZX84C15
  VD23: Value: BZX84C39
VD21 = 1.5KE: Value: 1.5KE150A
VD24 = SK34SMA: Schottky Rectifier; Value: {Value}
VT10 = IRFR9220: HEXFET Power MOSFET; OriginalName: IRLML5103; ComponentField7: Published 8-Jun-2000; Value: FQD7P20
VT11 = BC857B: PNP 100ma transistor; OriginalName: BC846BLT1; ComponentField7: Published 29-Sep-2000; Value: BC857
FU6 = RXE-110: Value: *
VD22 = LED_0805: Value: LED_0805

## Sheet [11]-POWER_BACKUP.SchDoc
size A4
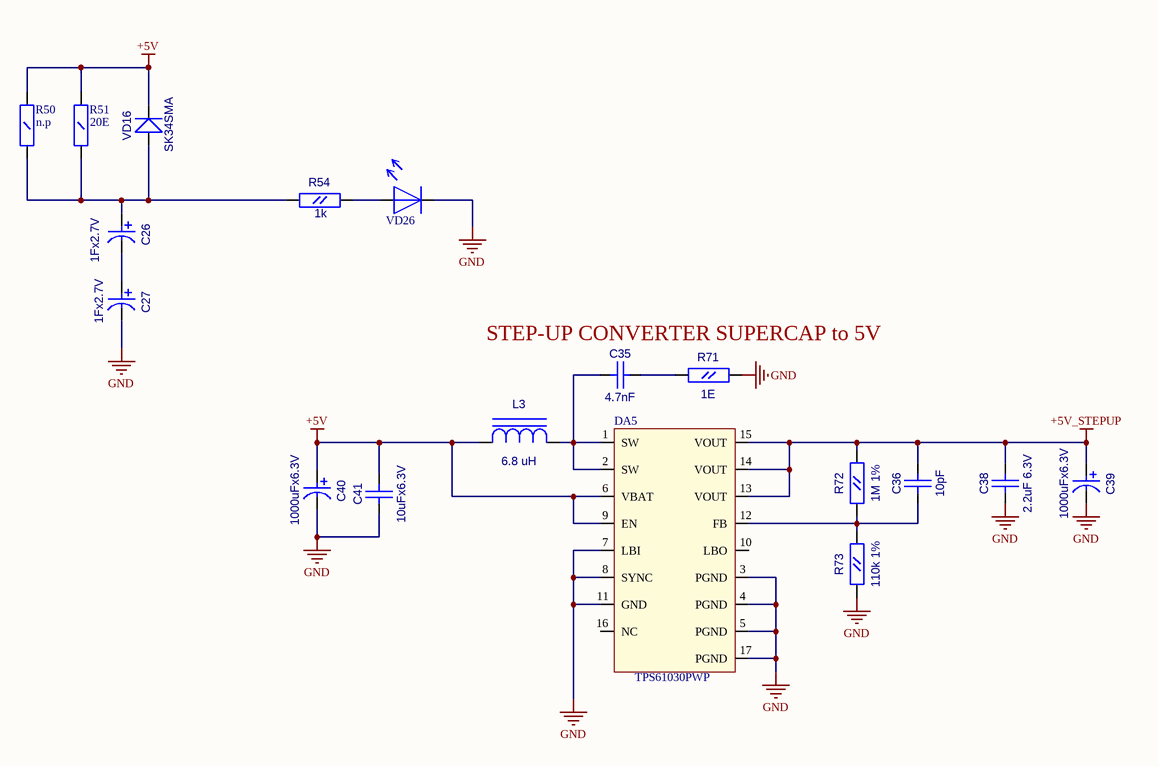
[diagram p10: [11]-POWER_BACKUP.SchDoc]

### Parts
C26  1Fx2.7V  [CC8X11.5_L]
C27  1Fx2.7V  [CC8X11.5_L]
C35  4.7nF  [CC0603]
C36  10pF  [CC0603]
C38  2.2uF 6.3V  [CC0805]
C39  value 1000uFx6.3V  [CC8X3.5]  (hidden comment: CAP0.35)
C40  value 1000uFx6.3V  [CC8X3.5]  (hidden comment: CAP0.35)
C41  10uFx6.3V  [CC0805]
DA5  TPS61030PWP  [R-PDSO-G16]
L3  6.8 uH  [SDR0805]
R50  n.p  [R2512]
R51  20E  [R2512]
R54  1k  [RC0603]
R71  1E  [RC0603]
R72  1M 1%  [RC0603]
R73  110k 1%  [RC0603]
VD16  SK34SMA  [SMA]
VD26  LED_0805  [LED0805]  (value not drawn)

### Nets
+5V: C40.1 C41.2(B) DA5.6(VBAT) DA5.9(EN) L3.1(C) R50.2(B) R51.2(B) VD16.2(K)
+5V_STEPUP: C36.2(B) C38.2(B) C39.1 DA5.13(VOUT) DA5.14(VOUT) DA5.15(VOUT) R72.2(B)
GND: C27.2 C38.1(A) C39.2 C40.2 C41.1(A) DA5.3(PGND) DA5.4(PGND) DA5.5(PGND) DA5.7(LBI) DA5.8(SYNC) DA5.11(GND) DA5.17(PGND) R71.2(B) R73.1(A) VD26.2
NetC26_1: C26.1 R50.1(A) R51.1(A) R54.1(A) VD16.1(A)
NetC26_2: C26.2 C27.1
NetC35_1: C35.1(A) DA5.1(SW) DA5.2(SW) L3.2(A)
NetC35_2: C35.2(B) R71.1(A)
NetC36_1: C36.1(A) DA5.12(FB) R72.1(A) R73.2(B)
NetR54_2: R54.2(B) VD26.1

Not connected (* = marked no-connect by the designer): DA5 10(LBO) 16(NC)

### Notes on the sheet
- STEP-UP CONVERTER SUPERCAP to 5V

### Library data of the parts
C26 C27 = CAP_8mm: Radial capacitor; Value: 1Fx2.7V
C35 C36 = CC0603
  C35: Value: 4.7nF
  C36: Value: 10pF
C38 C41 = CC0805
  C38: Value: 2.2uF 6.3V
  C41: Value: 10uFx6.3V
DA5 = TPS61030PWP: Boost converter
L3 = SDR0805: Value: 6.8 uH
R50 R51 = RC2512: Resistor 2512 1W
  R50: Value: n.p
  R51: Value: 20E
R54 R71-R73 = RC0603
  R54: Value: 1k
  R71: Value: 1E
  R72: Value: 1M 1%
  R73: Value: 110k 1%
VD16 = SK34SMA: Schottky Rectifier; Value: {Value}
VD26 = LED_0805: Value: LED_0805

## Sheet [12]-POWER_CONNECTORS.SchDoc
size A4
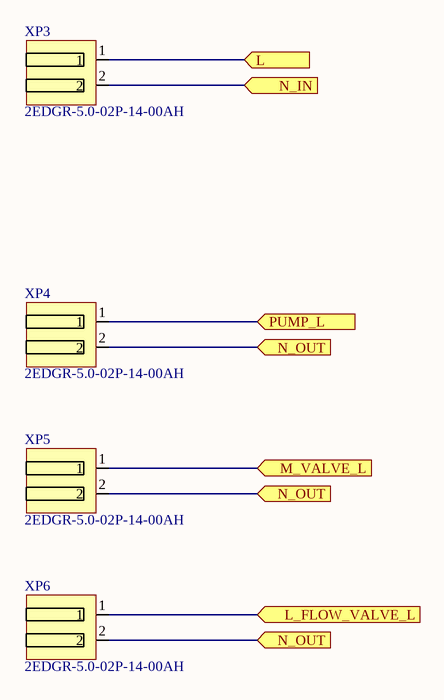
[diagram p11: [12]-POWER_CONNECTORS.SchDoc]

### Parts
XP3  2EDGR-5.0-02P-14-00AH  [2EDGR-5.0]
XP4  2EDGR-5.0-02P-14-00AH  [2EDGR-5.0]
XP5  2EDGR-5.0-02P-14-00AH  [2EDGR-5.0]
XP6  2EDGR-5.0-02P-14-00AH  [2EDGR-5.0]

### Ports
L (in), L_FLOW_VALVE_L (in), M_VALVE_L (in), N_IN (in), N_OUT (in), PUMP_L (in)

### Nets
NetC31_2: XP4.1 ; port PUMP_L
NetC33_2: XP6.1 ; port L_FLOW_VALVE_L
NetC37_2: XP5.1 ; port M_VALVE_L
NetF1_1: XP3.1 ; port L
NetF2_1: XP3.2 ; port N_IN
NetF2_2: XP4.2 XP5.2 XP6.2 ; port N_OUT

### Library data of the parts
XP3-XP6 = 2EDGR-5.0-02P-14-00AH: Value: 2EDGR-5.0-02P-14-00AH

## Sheet [13]-KB_CONNECTORS.SchDoc
size A4
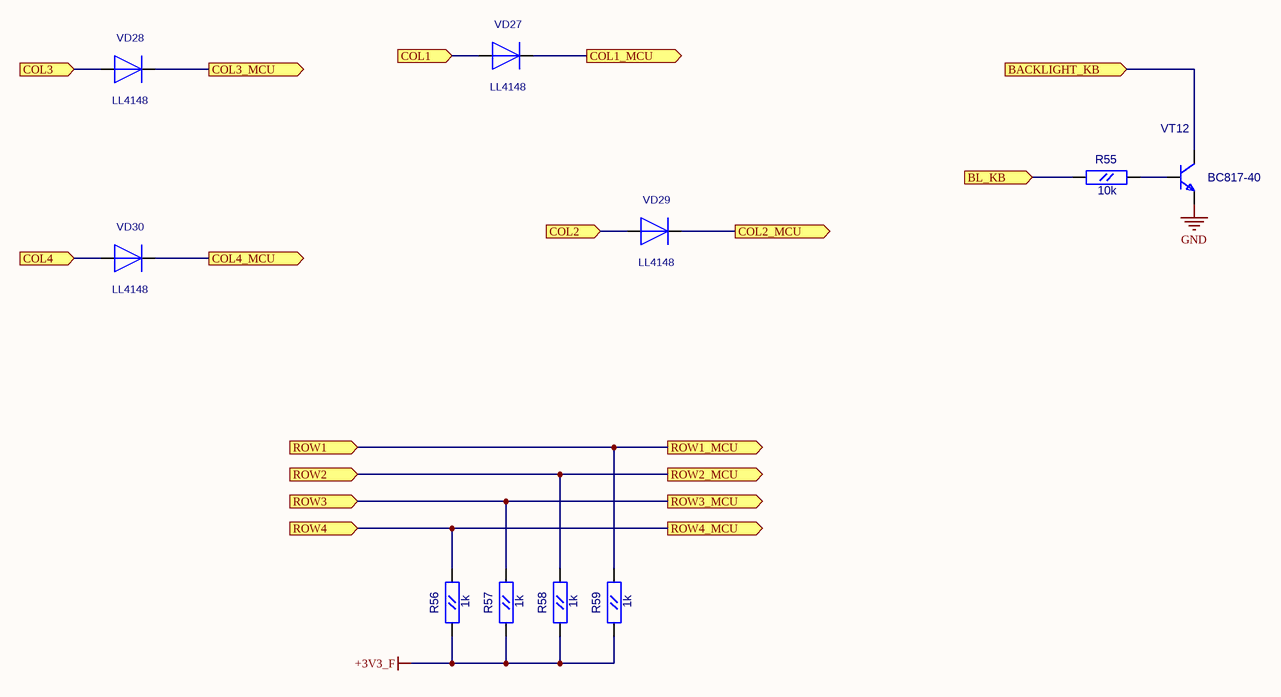
[diagram p12: [13]-KB_CONNECTORS.SchDoc]

### Parts
R55  10k  [RC0603]
R56  1k  [RC0603]
R57  1k  [RC0603]
R58  1k  [RC0603]
R59  1k  [RC0603]
VD27  LL4148  [SOD-80]
VD28  LL4148  [SOD-80]
VD29  LL4148  [SOD-80]
VD30  LL4148  [SOD-80]
VT12  BC817-40  [SOT-23(123)]

### Ports
BACKLIGHT_KB (in), BL_KB (in), COL1 (in), COL1_MCU (out), COL2 (in), COL2_MCU (out), COL3 (in), COL3_MCU (out), COL4 (in), COL4_MCU (out), ROW1 (in), ROW1_MCU (out), ROW2 (in), ROW2_MCU (out), ROW3 (in), ROW3_MCU (out), ROW4 (in), ROW4_MCU (out)

### Nets
+3V3_F: R56.1(A) R57.1(A) R58.1(A) R59.1(A)
GND: VT12.2(E)
BL_KB: R55.1(A) ; port BL_KB
COL1_MCU: VD27.2(+) ; port COL1_MCU
COL2_MCU: VD29.2(+) ; port COL2_MCU
COL3_MCU: VD28.2(+) ; port COL3_MCU
COL4_MCU: VD30.2(+) ; port COL4_MCU
ROW1_MCU: R59.2(B) ; port ROW1_MCU, port ROW1
ROW2_MCU: R58.2(B) ; port ROW2_MCU, port ROW2
ROW3_MCU: R57.2(B) ; port ROW3_MCU, port ROW3
ROW4_MCU: R56.2(B) ; port ROW4_MCU, port ROW4
NetR55_2: R55.2(B) VT12.1(B)
NetVD27_1: VD27.1(-) ; port COL1
NetVD28_1: VD28.1(-) ; port COL3
NetVD29_1: VD29.1(-) ; port COL2
NetVD30_1: VD30.1(-) ; port COL4
NetVT12_3: VT12.3(C) ; port BACKLIGHT_KB

### Library data of the parts
R55-R59 = RC0603
  R55: Value: 10k
  R56-R59: Value: 1k
VT12 = BC846BLT1: as VT1 on sheet [6]-MCU_CONNECTORS; OriginalName: BC846BLT1; Value: BC817-40
VD27-VD30 = LL4148: Value: *

## Sheet [14]-RTC.SchDoc
size A4
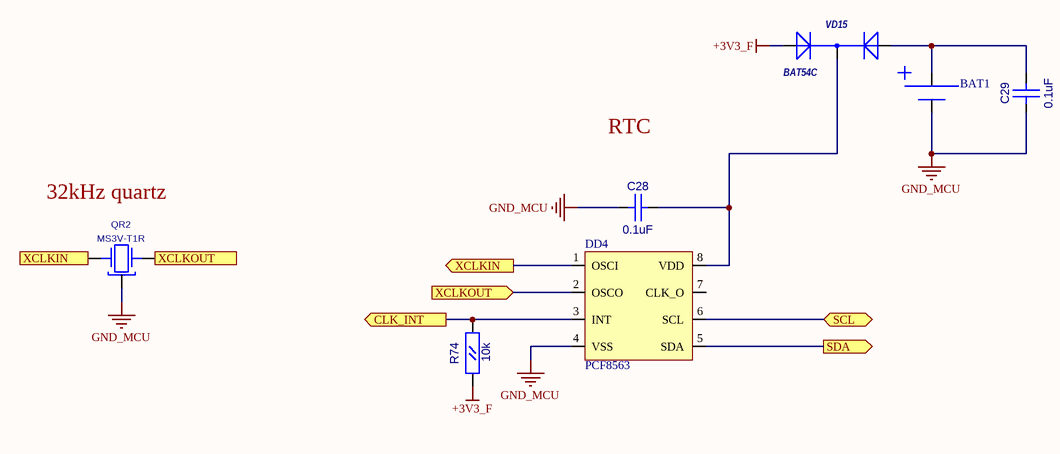
[diagram p13: [14]-RTC.SchDoc]

### Parts
BAT1  CR2032-VBY4  [CR2032_ONBOARD]  (value not drawn)
C28  0.1uF  [CC0603]
C29  0.1uF  [CC0603]
DD4  PCF8563  [SO-8]
QR2  MS3V-T1R  [MS3V-T1R]
R74  10k  [RC0603]
VD15  BAT54C  [SOT-23(123)]

### Ports
CLK_INT (out), SCL (bidir), SDA (out), XCLKIN (in), XCLKIN (out), XCLKOUT (in), XCLKOUT (out)

### Nets
+3V3_F: R74.1(A) VD15.1(A)
GND_MCU: BAT1.1 C28.1(A) C29.1(A) DD4.4(VSS) QR2.3
CLK_INT: DD4.3(INT) R74.2(B) ; port CLK_INT
SCL: DD4.6(SCL) ; port SCL
SDA: DD4.5(SDA) ; port SDA
NetBAT1_2: BAT1.2 C29.2(B) VD15.2(A)
NetC28_2: C28.2(B) DD4.8(VDD) VD15.3(K)
NetDD4_1: DD4.1(OSCI) QR2.2(X2) ; port XCLKIN
NetDD4_2: DD4.2(OSCO) QR2.1(X1) ; port XCLKOUT

Not connected (* = marked no-connect by the designer): DD4 7(CLK_O)

### Notes on the sheet
- RTC
- (near QR2) 32kHz quartz

### Library data of the parts
BAT1 = CR2032-VBY2: Value: CR2032-VBY4
C28 C29 = CC0603: Value: 0.1uF
QR2 = MS3V-T1R: CRYSTAL_32768 Hz; Value: MS3V-T1R
R74 = RC0603: Value: 10k
DD4 = PCF8563: Value: PCF8563
VD15 = BAT54C: Value: *

## Sheet [15]-MAIN_CONNECTORS.SchDoc
size A4
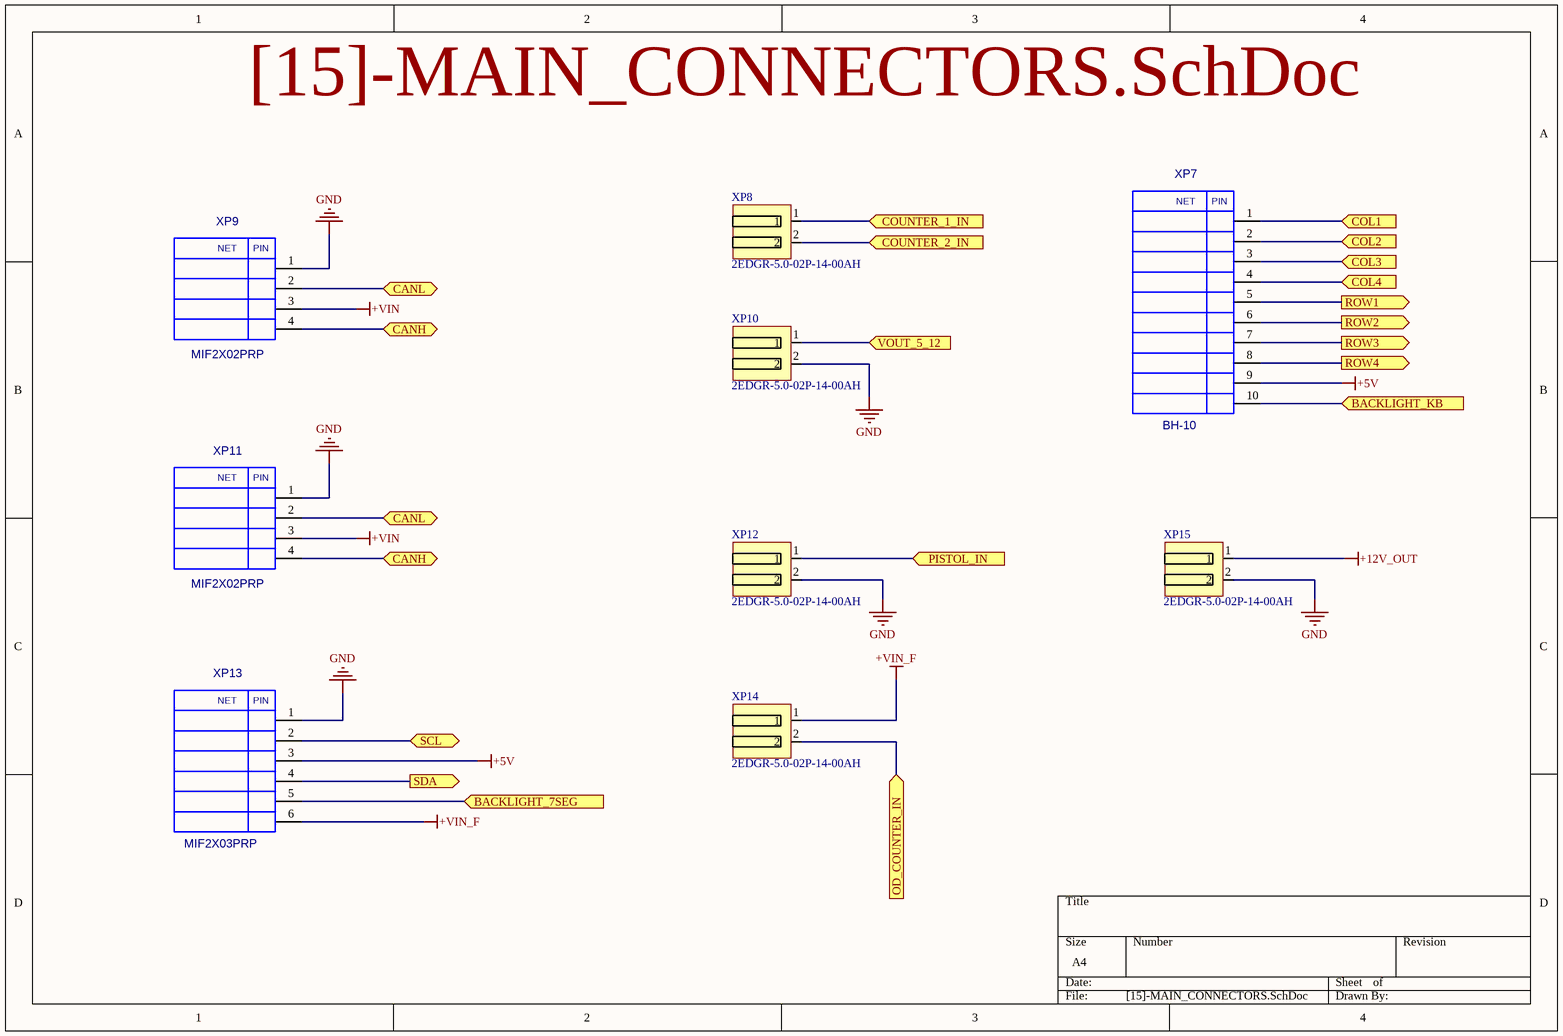
[diagram p14: [15]-MAIN_CONNECTORS.SchDoc]

### Parts
XP7  BH-10  [BH-10]
XP8  2EDGR-5.0-02P-14-00AH  [2EDGR-5.0]
XP9  MIF2X02PRP  [MIF2X02PRP]
XP10  2EDGR-5.0-02P-14-00AH  [2EDGR-5.0]
XP11  MIF2X02PRP  [MIF2X02PRP]
XP12  2EDGR-5.0-02P-14-00AH  [2EDGR-5.0]
XP13  MIF2X03PRP  [MIF2X03PRP]
XP14  2EDGR-5.0-02P-14-00AH  [2EDGR-5.0]
XP15  2EDGR-5.0-02P-14-00AH  [2EDGR-5.0]

### Ports
BACKLIGHT_7SEG (in), BACKLIGHT_KB (in), CANH (bidir), CANL (bidir), COL1 (in), COL2 (in), COL3 (in), COL4 (in), COUNTER_1_IN (in), COUNTER_2_IN (in), OD_COUNTER_IN (in), PISTOL_IN (in), ROW1 (out), ROW2 (out), ROW3 (out), ROW4 (out), SCL (bidir), SDA (out), VOUT_5_12 (in)

### Nets
+5V: XP7.9 XP13.3
+12V_OUT: XP15.1
+VIN: XP9.3 XP11.3
+VIN_F: XP13.6 XP14.1
GND: XP9.1 XP10.2 XP11.1 XP12.2 XP13.1 XP15.2
ROW1_MCU: XP7.5 ; port ROW1
ROW2_MCU: XP7.6 ; port ROW2
ROW3_MCU: XP7.7 ; port ROW3
ROW4_MCU: XP7.8 ; port ROW4
SCL: XP13.2 ; port SCL
SDA: XP13.4 ; port SDA
NetFU1_2: XP9.2 XP11.2 ; port CANL
NetFU2_2: XP9.4 XP11.4 ; port CANH
NetFU5_2: XP10.1 ; port VOUT_5_12
NetR16_1: XP8.1 ; port COUNTER_1_IN
NetR22_1: XP12.1 ; port PISTOL_IN
NetR28_1: XP8.2 ; port COUNTER_2_IN
NetVD8_2: XP14.2 ; port OD_COUNTER_IN
NetVD27_1: XP7.1 ; port COL1
NetVD28_1: XP7.3 ; port COL3
NetVD29_1: XP7.2 ; port COL2
NetVD30_1: XP7.4 ; port COL4
NetVT5_3: XP13.5 ; port BACKLIGHT_7SEG
NetVT12_3: XP7.10 ; port BACKLIGHT_KB

### Notes on the sheet
- (in symbol BH-10) NET; PIN
- (in symbol MIF2X02PRP) NET; PIN
- (in symbol MIF2X03PRP) NET; PIN

### Library data of the parts
XP7 = BH-10: Value: *
XP8 XP10 XP12 XP14 XP15 = 2EDGR-5.0-02P-14-00AH: Value: 2EDGR-5.0-02P-14-00AH
XP9 XP11 = MIF2X02PRP: Value: *
XP13 = MIF2X03PRP: Value: *

## Nets that join several sheets
+3V3_F: [3]-MCU_MAIN (8 pins), [4]-MCU_MEMORY (8 pins), [5]-MCU_POWER (DA3.4 R62.2), [6]-MCU_CONNECTORS (6 pins), [7]-INPUTS (9 pins), [13]-KB_CONNECTORS (R56.1 R57.1 R58.1 R59.1), [14]-RTC (R74.1 VD15.1)
+5V: [8]-OUTPUTS (XP2.3), [9]-RELAYS (VD9.1), [10]-MAIN_POWER (C19.1 C20.1 L2.2 R46.2), [11]-POWER_BACKUP (8 pins), [15]-MAIN_CONNECTORS (XP7.9 XP13.3)
+5V_STEPUP: [3]-MCU_MAIN (C3.2 DD1.20), [5]-MCU_POWER (C12.1 DA1.1 DA1.3), [11]-POWER_BACKUP (7 pins)
+12V_OUT: [8]-OUTPUTS (C30.1 C34.1 DA4.3), [15]-MAIN_CONNECTORS (XP15.1)
+VIN: [10]-MAIN_POWER (FU6.1), [15]-MAIN_CONNECTORS (XP9.3 XP11.3)
+VIN_F: [5]-MCU_POWER (R6.1), [7]-INPUTS (J4.2 J5.2 J6.2), [8]-OUTPUTS (6 pins), [10]-MAIN_POWER (5 pins), [15]-MAIN_CONNECTORS (XP13.6 XP14.1)
GND: [5]-MCU_POWER (7 pins), [6]-MCU_CONNECTORS (VD4.3), [7]-INPUTS (U1.2 U2.2 U3.2), [8]-OUTPUTS (7 pins), [9]-RELAYS (5 pins), [10]-MAIN_POWER (18 pins), [11]-POWER_BACKUP (15 pins), [13]-KB_CONNECTORS (VT12.2), [15]-MAIN_CONNECTORS (6 pins)
GND_MCU: [3]-MCU_MAIN (12 pins), [4]-MCU_MEMORY (C7.2 C8.2 DD2.4 DD3.4), [5]-MCU_POWER (5 pins), [6]-MCU_CONNECTORS (9 pins), [7]-INPUTS (6 pins), [14]-RTC (5 pins)
BL_7SEG: [3]-MCU_MAIN (DD1.31), [8]-OUTPUTS (R34.1)
BL_KB: [3]-MCU_MAIN (DD1.25), [13]-KB_CONNECTORS (R55.1)
BUZZER: [3]-MCU_MAIN (DD1.23), [6]-MCU_CONNECTORS (R12.1)
CANH: [3]-MCU_MAIN (DD1.19), [6]-MCU_CONNECTORS (FU2.1 R13.2 VD4.1)
CANL: [3]-MCU_MAIN (DD1.18), [6]-MCU_CONNECTORS (FU1.1 J2.1 VD4.2)
CLK_INT: [3]-MCU_MAIN (DD1.34), [14]-RTC (DD4.3 R74.2)
COL1_MCU: [3]-MCU_MAIN (DD1.27), [13]-KB_CONNECTORS (VD27.2)
COL2_MCU: [3]-MCU_MAIN (DD1.28), [13]-KB_CONNECTORS (VD29.2)
COL3_MCU: [3]-MCU_MAIN (DD1.29), [13]-KB_CONNECTORS (VD28.2)
COL4_MCU: [3]-MCU_MAIN (DD1.32), [13]-KB_CONNECTORS (VD30.2)
COUNTER_1: [3]-MCU_MAIN (DD1.45), [7]-INPUTS (R17.1 VT2.3)
COUNTER_2: [3]-MCU_MAIN (DD1.33), [7]-INPUTS (R29.1 VT4.3)
ISP_START: [3]-MCU_MAIN (DD1.4), [6]-MCU_CONNECTORS (C14.2 J3.1 R14.2)
L_FL_VLV_RELAY: [3]-MCU_MAIN (DD1.12), [9]-RELAYS (R41.1)
M/S: [3]-MCU_MAIN (DD1.48), [6]-MCU_CONNECTORS (J9.1 R70.2)
M_VLV_RELAY: [3]-MCU_MAIN (DD1.11), [9]-RELAYS (R67.1)
MISO: [3]-MCU_MAIN (DD1.26), [4]-MCU_MEMORY (DD2.2 DD3.2)
MOSI: [3]-MCU_MAIN (DD1.38), [4]-MCU_MEMORY (DD2.5 DD3.5)
NetC31_2: [9]-RELAYS (C31.2 REL2.5), [12]-POWER_CONNECTORS (XP4.1)
NetC33_2: [9]-RELAYS (C33.2 REL1.5), [12]-POWER_CONNECTORS (XP6.1)
NetC37_2: [9]-RELAYS (C37.2 REL3.5), [12]-POWER_CONNECTORS (XP5.1)
NetF1_1: [9]-RELAYS (F1.1 RV1.2), [12]-POWER_CONNECTORS (XP3.1)
NetF2_1: [9]-RELAYS (F2.1 RV1.1), [12]-POWER_CONNECTORS (XP3.2)
NetF2_2: [9]-RELAYS (F2.2), [12]-POWER_CONNECTORS (XP4.2 XP5.2 XP6.2)
NetFU1_2: [6]-MCU_CONNECTORS (FU1.2), [15]-MAIN_CONNECTORS (XP9.2 XP11.2)
NetFU2_2: [6]-MCU_CONNECTORS (FU2.2), [15]-MAIN_CONNECTORS (XP9.4 XP11.4)
NetFU5_2: [8]-OUTPUTS (FU5.2), [15]-MAIN_CONNECTORS (XP10.1)
NetR16_1: [7]-INPUTS (R16.1 R19.1), [15]-MAIN_CONNECTORS (XP8.1)
NetR22_1: [7]-INPUTS (R22.1 R25.1), [15]-MAIN_CONNECTORS (XP12.1)
NetR28_1: [7]-INPUTS (R28.1 R31.1), [15]-MAIN_CONNECTORS (XP8.2)
NetVD8_2: [8]-OUTPUTS (VD8.2 VD14.1 VT6.3), [15]-MAIN_CONNECTORS (XP14.2)
NetVD27_1: [13]-KB_CONNECTORS (VD27.1), [15]-MAIN_CONNECTORS (XP7.1)
NetVD28_1: [13]-KB_CONNECTORS (VD28.1), [15]-MAIN_CONNECTORS (XP7.3)
NetVD29_1: [13]-KB_CONNECTORS (VD29.1), [15]-MAIN_CONNECTORS (XP7.2)
NetVD30_1: [13]-KB_CONNECTORS (VD30.1), [15]-MAIN_CONNECTORS (XP7.4)
NetVT5_3: [8]-OUTPUTS (VT5.3), [15]-MAIN_CONNECTORS (XP13.5)
NetVT12_3: [13]-KB_CONNECTORS (VT12.3), [15]-MAIN_CONNECTORS (XP7.10)
OD_COUNTER: [3]-MCU_MAIN (DD1.30), [8]-OUTPUTS (R35.1)
PISTOL_MCU: [3]-MCU_MAIN (DD1.24), [7]-INPUTS (R23.1 VT3.3)
PUMP_RELAY: [3]-MCU_MAIN (DD1.1), [9]-RELAYS (R60.1)
RESET: [3]-MCU_MAIN (DD1.3), [6]-MCU_CONNECTORS (C13.2 J1.1 R11.2)
ROW1_MCU: [3]-MCU_MAIN (DD1.39), [13]-KB_CONNECTORS (R59.2), [15]-MAIN_CONNECTORS (XP7.5)
ROW2_MCU: [3]-MCU_MAIN (DD1.40), [13]-KB_CONNECTORS (R58.2), [15]-MAIN_CONNECTORS (XP7.6)
ROW3_MCU: [3]-MCU_MAIN (DD1.36), [13]-KB_CONNECTORS (R57.2), [15]-MAIN_CONNECTORS (XP7.7)
ROW4_MCU: [3]-MCU_MAIN (DD1.37), [13]-KB_CONNECTORS (R56.2), [15]-MAIN_CONNECTORS (XP7.8)
RXD: [3]-MCU_MAIN (DD1.46), [6]-MCU_CONNECTORS (XP1.3)
SCK: [3]-MCU_MAIN (DD1.13), [4]-MCU_MEMORY (DD2.6 DD3.6)
SCL: [3]-MCU_MAIN (DD1.15 R4.1), [14]-RTC (DD4.6), [15]-MAIN_CONNECTORS (XP13.2)
SDA: [3]-MCU_MAIN (DD1.16 R3.1), [14]-RTC (DD4.5), [15]-MAIN_CONNECTORS (XP13.4)
SETTINGS_BLOCK: [3]-MCU_MAIN (DD1.43), [6]-MCU_CONNECTORS (J8.2 R65.1)
SETTINGS_DEF: [3]-MCU_MAIN (DD1.42), [6]-MCU_CONNECTORS (J7.2 R52.2)
SS0: [3]-MCU_MAIN (DD1.2), [4]-MCU_MEMORY (DD2.1)
SS1: [3]-MCU_MAIN (DD1.14), [4]-MCU_MEMORY (DD3.1)
TXD: [3]-MCU_MAIN (DD1.47), [6]-MCU_CONNECTORS (R9.1)
V_IN: [3]-MCU_MAIN (DD1.35), [5]-MCU_POWER (C11.2 R6.2 R7.2 VD3.3)